# Altium project DClassAmp.PrjPcb (part 2 of 2)

## Sheet ClockGen.SchDoc
size 431 x 279 mm; Organization: ORGANIZATION; Address1: 207; Address2: 13399 104 Ave; Address3: Surrey BC, V3T 0C9; Address4: Canada; Revision: V0.0.0; SheetNumber: 5; SheetTotal: 5; ENG_APP_DATE: --/--/--; DSN_APP_DATE: --/--/--; CHK_APP_DATE: --/--/--
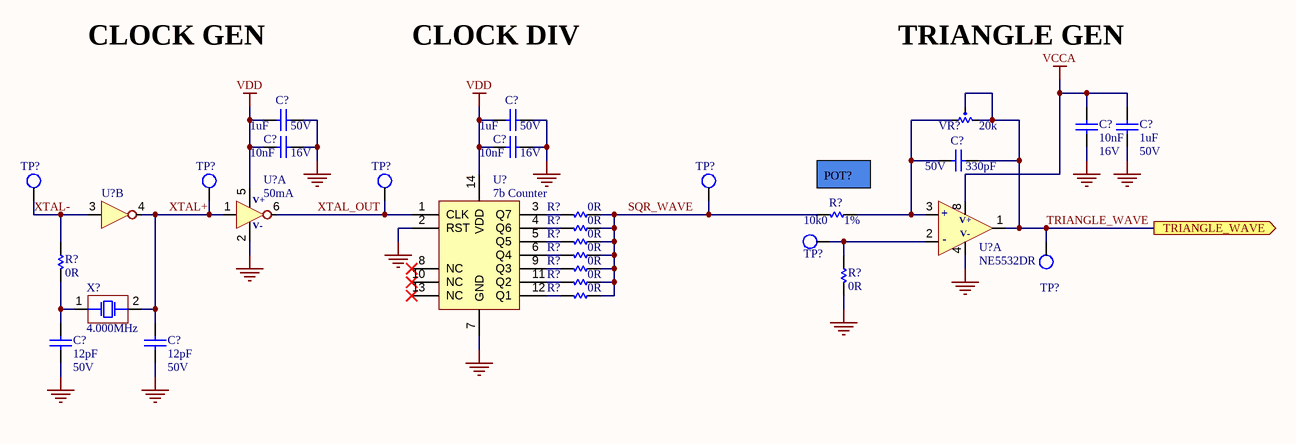
[diagram p2: ClockGen.SchDoc]

### Parts
(Parts that share a designator on the sheet are numbered #1, #2 ... from top to bottom, then left to right.)
C?#11  1uF  Voltage Rating: 50V
C?#12  1uF  Voltage Rating: 50V
C?#13  10nF  Voltage Rating: 16V  [c0402]
C?#14  1uF  Voltage Rating: 50V
C?#15  10nF  Voltage Rating: 16V  [c0402]
C?#16  10nF  Voltage Rating: 16V  [c0402]
C?#17  330pF  Voltage Rating: 50V  [c0402]
C?#18  12pF  Voltage: 50V  [C0402]
C?#19  12pF  Voltage: 50V  [C0402]
R?#19  0R  [R0402]
R?#20  10k0  Tolerance: 1%  [r0402]
R?#21  0R  [R0402]
R?#22  0R  [R0402]
R?#23  0R  [R0402]
R?#24  0R  [R0402]
R?#25  0R  [R0402]
R?#26  0R  [R0402]
R?#27  0R  [R0402]
R?#28  0R  [R0402]
TP?#17  1mm  [TESTPOINT_SMT]  (value not drawn)
TP?#18  1mm  [TESTPOINT_SMT]  (value not drawn)
TP?#19  1mm  [TESTPOINT_SMT]  (value not drawn)
TP?#20  1mm  [TESTPOINT_SMT]  (value not drawn)
TP?#21  1mm  [TESTPOINT_SMT]  (value not drawn)
TP?#22  1mm  [TESTPOINT_SMT]  (value not drawn)
U?#5  50mA  [SOT-23 6 2.9x2.8mm TI DBV0006A]  (value not drawn)  (part B of 2)
U?#6  50mA  [SOT-23 6 2.9x2.8mm TI DBV0006A]  (part A of 2)
U?#7  7b Counter  [SOIC14 8.65x3.9]
U?#8  NE5532DR  [SO8 6.2x5mm TI D0008A]  (part A of 2)
VR?#2  20k  [RV TC33X-2]
X?  4.000MHz  [XTAL 2pin]

### Ports
TRIANGLE_WAVE (out)

### Nets
GND: C?#11.1 C?#12.1 C?#13.1 C?#14.1 C?#15.1 C?#16.1 C?#18.1 C?#19.1 R?#26.2 U?#6.2(GND) U?#7.2(RST) U?#7.7(GND) U?#8.4(V-)
VCCA: C?#13.2 C?#14.2 U?#8.8(V+)
VDD: C?#11.2 C?#12.2 C?#15.2 C?#16.2 U?#6.5(PWR) U?#7.14(VDD)
SQR_WAVE: R?#19.1 R?#20.2 R?#21.1 R?#22.1 R?#24.1 R?#25.1 R?#27.1 R?#28.1 TP?#20.1
TRIANGLE_WAVE: C?#17.1 TP?#22.1 U?#8.1 VR?#2.3 ; port TRIANGLE_WAVE
XTAL+: C?#19.2 TP?#18.1 U?#5.4 U?#6.1 X?.2
XTAL-: R?#23.1 TP?#17.1 U?#5.3
XTAL_OUT: TP?#19.1 U?#6.6 U?#7.1(CLK)
NetC?#17_2: C?#17.2 R?#20.1 U?#8.3(+) VR?#2.1
NetC?#18_2: C?#18.2 R?#23.2 X?.1
NetR?#19_2: R?#19.2 U?#7.3(Q7)
NetR?#21_2: R?#21.2 U?#7.4(Q6)
NetR?#22_2: R?#22.2 U?#7.5(Q5)
NetR?#24_2: R?#24.2 U?#7.6(Q4)
NetR?#25_2: R?#25.2 U?#7.9(Q3)
NetR?#26_1: R?#26.1 TP?#21.1 U?#8.2(-)
NetR?#27_2: R?#27.2 U?#7.11(Q2)
NetR?#28_2: R?#28.2 U?#7.12(Q1)

Not connected (* = marked no-connect by the designer): U?#7 8(NC)* 10(NC)* 13(NC)*

### Notes on the sheet
- CLOCK GEN
- CLOCK DIV
- TRIANGLE GEN
- (near R?#20) POT?
- REV:
- PROJECT:
- DATE:
- TITLE
- SHEET
- OF
- DESIGNED:
- REVIEWED:
- (in symbol IC LOGIC INVERTER 2x 50mA, part A) V+; V-

### Library data of the parts
C?#11 C?#12 C?#14 = CAP CER 1uF 50V X5R 0603: Multilayer Ceramic Capacitors (High dielectric type), 50V, 1 uF, ± 10 %, 0603, X5R, RoHS; Manufacturer: Taiyo Yuden; Manufacturer Part Number: UMK107BJ105KA-T; Tolerance: 10%; Supplier 1: Digi-Key; RoHS: Yes; Category: Ceramic Capacitors; Stock 1: 955108; Pricing 1: 1=0.19000, 10=0.12900, 50=0.07760, 100=0.06560, 500=0.04484, 1000=0.03968 (USD); Mount: Surface Mount; Case/Package: 0603; Number of Pins: 2; Case Code (Metric): 1608; Case Code (Imperial): 0603; Contact Plating: Nickel; Min Operating Temperature: -55°C; Max Operating Temperature: 85°C; Capacitance: 1uF; Packaging: Tape and Reel; Package Quantity: 1; Dielectric: X5R; Voltage Rating (DC): 50V; Termination: SMD/SMT; Series: M; Construction: Flat; Length: 1.6mm; Width: 0.031inch; Height: 0.8mm; Depth: 0.8mm; Thickness: 0.035inch; Radiation Hardening: No; RoHS Compliant: Yes; REACH SVHC: Unknown; Halogen Free: Halogen Free; ComponentLink1URL: https://datasheet.ciiva.com/134/umk107bj105ka-t-ss-134740.pdf?src-supplier=Digi-Key; ComponentLink1Description: https://datasheet.ciiva.com/134/umk107bj105ka-t-ss-134740.pdf?src-supplier=Digi-Key; ComponentLink2URL: https://datasheet.ciiva.com/11601/umk107bj105ka-t-ss-11601811.pdf?src-supplier=Avnet; ComponentLink2Description: https://datasheet.ciiva.com/11601/umk107bj105ka-t-ss-11601811.pdf?src-supplier=Avnet; ComponentLink3URL: https://datasheet.ciiva.com/5744/1697715-5744913.pdf?src-supplier=Farnell; ComponentLink3Description: https://datasheet.ciiva.com/5744/1697715-5744913.pdf?src-supplier=Farnell; ComponentLink4URL: https://datasheet.ciiva.com/30199/43umk107bj105ka-t-30199791.pdf?src-supplier=Onlinecomponents.com; ComponentLink4Description: https://datasheet.ciiva.com/30199/43umk107bj105ka-t-30199791.pdf?src-supplier=Onlinecomponents.com; ComponentLink5URL: https://datasheet.ciiva.com/15922/336umk107bj105ka-t-15922611.pdf?src-supplier=Onlinecomponents.com; ComponentLink5Description: https://datasheet.ciiva.com/15922/336umk107bj105ka-t-15922611.pdf?src-supplier=Onlinecomponents.com; ComponentLink6URL: https://datasheet.ciiva.com/5427/mlcc-all-e-541559-5427036.pdf?src-supplier=Mouser; ComponentLink6Description: https://datasheet.ciiva.com/5427/mlcc-all-e-541559-5427036.pdf?src-supplier=Mouser; ComponentLink7URL: https://datasheet.ciiva.com/7975/mlcc-all-e-7975898.pdf?src-supplier=Element14; ComponentLink7Description: https://datasheet.ciiva.com/7975/mlcc-all-e-7975898.pdf?src-supplier=Element14; ComponentLink8URL: https://datasheet.ciiva.com/7975/1697715-7975608.pdf?src-supplier=Element14; ComponentLink8Description: https://datasheet.ciiva.com/7975/1697715-7975608.pdf?src-supplier=Element14; ComponentLink9URL: https://datasheet.ciiva.com/22694/1697715-22694278.pdf?src-supplier=Element14; ComponentLink9Description: https://datasheet.ciiva.com/22694/1697715-22694278.pdf?src-supplier=Element14; Supplier Part Number 1: 587-2400-1-ND
C?#13 C?#15 C?#16 = CAP CER 10nF 16V Y5V 0402: 0402 10 nF 16 V -20 / +80 % Tolerance Y5V SMT Multilayer Ceramic Capacitor; Manufacturer: Yageo; Manufacturer Part Number: CC0402ZRY5V7BB103; Tolerance: 80%; Insulation Resistance: 100GR; Supplier 1: Future Electronics; RoHS: Yes; Category: Ceramic Capacitors; Stock 1: 10000; Pricing 1: 10000=0.00340, 30000=0.00320, 100000=0.00300, 200000=0.00290, 400000=0.00270 (USD); Mount: Surface Mount; Case/Package: 0402; Number of Pins: 2; Case Code (Imperial): 0402; Case Code (Metric): 1005; Dielectric Material: Ceramic; Min Operating Temperature: -55°C; Max Operating Temperature: 85°C; Capacitance: 10nF; Packaging: Tape and Reel; Voltage Rating (DC): 16V; Dielectric: Y5V; Termination: SMD/SMT; Series: CC; Package Quantity: 10000; Construction: Flat; Length: 1mm; Width: 0.02inch; Height: 0.5mm; Depth: 0.5mm; Thickness: 0.022inch; Terminal Length: 0.225mm; Radiation Hardening: No; RoHS Compliant: Yes; Lead Free: Lead Free; REACH SVHC: No SVHC; Halogen Free: Halogen Free; ComponentLink1URL: https://datasheet.ciiva.com/144/mlccorderingcode-144484.pdf?src-supplier=Digi-Key; ComponentLink1Description: https://datasheet.ciiva.com/144/mlccorderingcode-144484.pdf?src-supplier=Digi-Key; ComponentLink2URL: https://datasheet.ciiva.com/144/mlccorderingcode-144485.pdf?src-supplier=Digi-Key; ComponentLink2Description: https://datasheet.ciiva.com/144/mlccorderingcode-144485.pdf?src-supplier=Digi-Key; ComponentLink3URL: https://datasheet.ciiva.com/144/mlccorderingcode-144486.pdf?src-supplier=Digi-Key; ComponentLink3Description: https://datasheet.ciiva.com/144/mlccorderingcode-144486.pdf?src-supplier=Digi-Key; ComponentLink4URL: https://datasheet.ciiva.com/11586/upy-gphc-y5v-6-3v-to-50v-5-11586517.pdf?src-supplier=Avnet; ComponentLink4Description: https://datasheet.ciiva.com/11586/upy-gphc-y5v-6-3v-to-50v-5-11586517.pdf?src-supplier=Avnet; ComponentLink5URL: https://datasheet.ciiva.com/5789/1132289-5789565.pdf?src-supplier=Farnell; ComponentLink5Description: https://datasheet.ciiva.com/5789/1132289-5789565.pdf?src-supplier=Farnell; ComponentLink6URL: https://datasheet.ciiva.com/5789/1132289-5789566.pdf?src-supplier=Farnell; ComponentLink6Description: https://datasheet.ciiva.com/5789/1132289-5789566.pdf?src-supplier=Farnell; ComponentLink7URL: https://datasheet.ciiva.com/17437/upy-gphc-y5v-6-3v-to-50v-5-17437221.pdf?src-supplier=Avnet+Europe; ComponentLink7Description: https://datasheet.ciiva.com/17437/upy-gphc-y5v-6-3v-to-50v-5-17437221.pdf?src-supplier=Avnet+Europe; ComponentLink8URL: https://datasheet.ciiva.com/8033/1132289-8033641.pdf?src-supplier=Element14; ComponentLink8Description: https://datasheet.ciiva.com/8033/1132289-8033641.pdf?src-supplier=Element14; ComponentLink9URL: https://datasheet.ciiva.com/8033/1132289-8033642.pdf?src-supplier=Element14; ComponentLink9Description: https://datasheet.ciiva.com/8033/1132289-8033642.pdf?src-supplier=Element14; Supplier Part Number 1: 1300987
C?#17 = CAP CER 330pF 50V C0G 0402: Multilayer Ceramic Capacitor, 330 pF, 5%, C0G / NP0, 50 V, 0402 [1005 Metric] RoHS Compliant: Yes; Manufacturer: Walsin Technologies; Manufacturer Part Number: 0402N331J500CT; Supplier 1: Digi-Key; RoHS: Yes; Category: Ceramic Capacitors; Stock 1: 670585; Pricing 1: 1=0.10000, 10=0.02700, 50=0.01460, 100=0.01190, 500=0.00848, 1000=0.00666, 2500=0.00605, 5000=0.00557 (USD); Case/Package: 0402; Case Code (Metric): 1005; Case Code (Imperial): 0402; Min Operating Temperature: -55°C; Max Operating Temperature: 125°C; Tolerance: 5%; Packaging: Tape and Reel; Capacitance: 330pF; Dielectric: C0G; Voltage Rating (DC): 50V; Length: 1mm; Depth: 0.5mm; REACH SVHC: Unknown; RoHS Compliant: Yes; ComponentLink1URL: http://www.farnell.com/datasheets/1958513.pdf?src-supplier=Farnell; ComponentLink1Description: http://www.farnell.com/datasheets/1958513.pdf?src-supplier=Farnell; ComponentLink2URL: http://www.farnell.com/datasheets/2340522.pdf?src-supplier=Farnell; ComponentLink2Description: http://www.farnell.com/datasheets/2340522.pdf?src-supplier=Farnell; ComponentLink3URL: http://components.arrow.com/part/dataview/0323_03460079?src-supplier=Arrow+Europe; ComponentLink3Description: http://components.arrow.com/part/dataview/0323_03460079?src-supplier=Arrow+Europe; ComponentLink4URL: http://www.farnell.com/datasheets/1958513.pdf?src-supplier=Element14; ComponentLink4Description: http://www.farnell.com/datasheets/1958513.pdf?src-supplier=Element14; ComponentLink5URL: http://www.passivecomponent.com/wp-content/uploads/2018/10/MLCC.pdf?src-supplier=Digi-Key; ComponentLink5Description: http://www.passivecomponent.com/wp-content/uploads/2018/10/MLCC.pdf?src-supplier=Digi-Key; Supplier Part Number 1: 1292-1308-1-ND
C?#18 C?#19 = CAP CER 12pF 50V C0G 0402: Ceramic capacitor SMD-0402 12pF /50V C0G# J +-5%, Samsung, RoHS; Manufacturer Part Number: CL05C120JB5NNNC; Tolerance: 5%; Dielectric: C0G; Temperature Coefficient: 300ppm/°C; Supplier 1: Digi-Key; Manufacturer: Samsung; RoHS: Yes; Category: Ceramic Capacitors; Stock 1: 41998; Pricing 1: 10000=0.00386, 20000=0.00367 (USD); Mount: Surface Mount; Case/Package: 0402; Case Code (Metric): 1005; Case Code (Imperial): 0402; Material: Ceramic; Contact Plating: Tin; Min Operating Temperature: -55°C; Max Operating Temperature: 125°C; Capacitance: 12pF; Package Quantity: 1; Packaging: Tape and Reel; Voltage Rating: 50V; Series: CL; Construction: Flat; Voltage Rating (DC): 50V; Length: 1mm; Width: 0.02inch; Height: 0.5mm; Thickness: 0.022inch; Depth: 0.5mm; Radiation Hardening: No; RoHS Compliant: Yes; Lead Free: Lead Free; ComponentLink1URL: https://datasheet.ciiva.com/25806/cl05c120jb5nnnc-25806484.pdf?src-supplier=Digi-Key; ComponentLink1Description: https://datasheet.ciiva.com/25806/cl05c120jb5nnnc-25806484.pdf?src-supplier=Digi-Key; ComponentLink2URL: https://datasheet.ciiva.com/26838/getdatasheetpartid-658047-26838280.pdf?src-supplier=Verical; ComponentLink2Description: https://datasheet.ciiva.com/26838/getdatasheetpartid-658047-26838280.pdf?src-supplier=Verical; ComponentLink3URL: https://datasheet.ciiva.com/29198/458703-da-01-en-vs-kondensator-0402-29198421.pdf?src-supplier=Conrad; ComponentLink3Description: https://datasheet.ciiva.com/29198/458703-da-01-en-vs-kondensator-0402-29198421.pdf?src-supplier=Conrad; ComponentLink4URL: https://datasheet.ciiva.com/16449/cl05b104kq5nnnc-16449055.pdf?src-supplier=Future+Electronics; ComponentLink4Description: https://datasheet.ciiva.com/16449/cl05b104kq5nnnc-16449055.pdf?src-supplier=Future+Electronics; Supplier Part Number 1: 1276-1178-2-ND
R?#19 R?#21-R?#28 = RES 0R 63mW 0402: GLOVE, POLYAMIDE, L/FREE, PU, SIZE 6 - More Details; Manufacturer: Stackpole Electronics; Manufacturer Part Number: RMCF0402ZT0R00; Power Rating: 63mW; Current Rating: 1A; Working Voltage: 50V; Supplier 1: Digi-Key; RoHS: Yes; Category: Chip SMD Resistors; Stock 1: 5203223; Pricing 1: 1=0.10000, 10=0.01000, 25=0.00720, 50=0.00560, 100=0.00410, 250=0.00316, 500=0.00252, 1000=0.00186, 5000=0.00133 (USD); Mount: Surface Mount; Case/Package: 0402; Case Code (Metric): 1005; Case Code (Imperial): 0402; Contact Plating: Tin,Matte; Min Operating Temperature: -55°C; Max Operating Temperature: 155°C; Resistance: 0R; Packaging: Tape and Reel; Resistor Type: Thick Film; Number of Terminations: 2; Max Power Dissipation: 63mW; Features: Automotive AEC-Q200; Series: RMCF; Technology: THICK FILM; Construction: Rectangular; Length: 0.039inch; Width: 0.02inch; Height: 0.016inch; Depth: 0.5mm; Radiation Hardening: No; Military Standard: Not; Lead Free: Lead Free; RoHS Compliant: Yes; ComponentLink1URL: https://datasheet.ciiva.com/26835/getdatasheetpartid-409751-26835612.pdf?src-supplier=Verical; ComponentLink1Description: https://datasheet.ciiva.com/26835/getdatasheetpartid-409751-26835612.pdf?src-supplier=Verical; Supplier Part Number 1: RMCF0402ZT0R00CT-ND
R?#20 = RES 10k0 1% 63mW 0402: Res General Purpose Thick Film 0402 10K Ohm 1% 1/16W ±100ppm/°C Molded SMD Paper T/R; Manufacturer: Yageo; Manufacturer Part Number: RC0402FR-0710KL; Resistance: 10kR; Voltage Rating (DC): 50V; Power Rating: 62.5mW; Max Power Dissipation: 63mW; Supplier 1: RSComponents; RoHS: Yes; Category: Chip SMD Resistors; Stock 1: 29900; Pricing 1: 10000=0.00300 (GBP); Case/Package: 0402; Number of Pins: 2; Case Code (Imperial): 0402; Case Code (Metric): 1005; Min Operating Temperature: -55°C; Max Operating Temperature: 155°C; Resistor Type: Thick Film; Temperature Coefficient: 100ppm/°C; Packaging: Tape and Reel; Voltage Rating: 50V; Termination: SMD/SMT; Working Voltage: 50V; Number of Terminations: 2; Features: Moisture Resistant; Series: RC; Resistance Tolerance: 1%; Construction: Rectangular; Length: 1mm; Width: 0.5mm; Height: 0.32mm; Depth: 0.5mm; Lead Pitch: 0.2mm; REACH SVHC: No SVHC; Lead Free: Lead Free; RoHS Compliant: Yes; Military Standard: Not; ComponentLink1URL: https://datasheet.ciiva.com/7660/38568-7660787.pdf?src-supplier=Element14; ComponentLink1Description: https://datasheet.ciiva.com/7660/38568-7660787.pdf?src-supplier=Element14; ComponentLink2URL: https://datasheet.ciiva.com/12667/pyu-rc0402-51-rohs-l-6-r-12667067.pdf?src-supplier=Mouser; ComponentLink2Description: https://datasheet.ciiva.com/12667/pyu-rc0402-51-rohs-l-6-r-12667067.pdf?src-supplier=Mouser; ComponentLink3URL: https://datasheet.ciiva.com/7849/1784430-7849813.pdf?src-supplier=Element14; ComponentLink3Description: https://datasheet.ciiva.com/7849/1784430-7849813.pdf?src-supplier=Element14; ComponentLink4URL: https://datasheet.ciiva.com/7849/1686128-7849814.pdf?src-supplier=Element14; ComponentLink4Description: https://datasheet.ciiva.com/7849/1686128-7849814.pdf?src-supplier=Element14; ComponentLink5URL: https://datasheet.ciiva.com/7849/1784430-7849815.pdf?src-supplier=Element14; ComponentLink5Description: https://datasheet.ciiva.com/7849/1784430-7849815.pdf?src-supplier=Element14; ComponentLink6URL: https://datasheet.ciiva.com/7983/1018594-7983486.pdf?src-supplier=Element14; ComponentLink6Description: https://datasheet.ciiva.com/7983/1018594-7983486.pdf?src-supplier=Element14; ComponentLink7URL: https://datasheet.ciiva.com/22747/1018594-22747512.pdf?src-supplier=Element14; ComponentLink7Description: https://datasheet.ciiva.com/22747/1018594-22747512.pdf?src-supplier=Element14; Supplier Part Number 1: 1987643
TP?#17-TP?#22 = TP 1mm: SMT testpoint
U?#5 U?#6 = IC LOGIC INVERTER 2x 50mA: Buffer 2-CH Non-Inverting Push-Pull CMOS 6-Pin SOT-23 T/R; Manufacturer: Texas Instruments; Manufacturer Part Number: SN74LVC2G34DBVR; Logic Function: Buffer,Inverting; Min Supply Voltage: 1.65V; Max Supply Voltage: 5.5V; Number of Channels: 2; Propagation Delay: 3.2ns; Number of Bits per Element: 1; High Level Output Current: -32mA; Low Level Output Current: 32mA; Turn-On Delay Time: 8.6ns; Quiescent Current: 10uA; Schmitt Trigger Input: No; Nominal Supply Current: 250mA; Supplier 1: Arrow Electronics; RoHS: Yes; Category: Buffers, Drivers and Transceivers; Stock 1: 261; Pricing 1: 3000=0.09770 (USD); Mount: Surface Mount; Case/Package: SOT-23; Number of Pins: 6; Contact Plating: Tin,Matte; Min Operating Temperature: -40°C; Max Operating Temperature: 125°C; Polarity: Non-Inverting; Packaging: Tape and Reel; Number of Inputs: 2; Number of Outputs: 2; Package Quantity: 3000; Number of Elements: 2; Number of Input Lines: 2; Number of Output Lines: 2; Number of Gates: 2; Number of Bits: 2; Number of Circuits: 2; Output Current: 32mA; Max Output Current: 32mA; Termination: SMD/SMT; Length: 2.9mm; Width: 1.6mm; Height: 1.15mm; Radiation Hardening: No; Lead Free: Lead Free; RoHS Compliant: Yes; REACH SVHC: No SVHC; ComponentLink1URL: https://datasheet.ciiva.com/27051/1046431-27051311.pdf?src-supplier=Jameco; ComponentLink1Description: https://datasheet.ciiva.com/27051/1046431-27051311.pdf?src-supplier=Jameco; ComponentLink2URL: https://datasheet.ciiva.com/7744/1771621-7744033.pdf?src-supplier=Element14; ComponentLink2Description: https://datasheet.ciiva.com/7744/1771621-7744033.pdf?src-supplier=Element14; ComponentLink3URL: https://datasheet.ciiva.com/15094/getdatasheetpartid-133639-15094759.pdf?src-supplier=Verical; ComponentLink3Description: https://datasheet.ciiva.com/15094/getdatasheetpartid-133639-15094759.pdf?src-supplier=Verical; ComponentLink4URL: https://datasheet.ciiva.com/14301/sn74lvc2g34-14301216.pdf?src-supplier=Avnet; ComponentLink4Description: https://datasheet.ciiva.com/14301/sn74lvc2g34-14301216.pdf?src-supplier=Avnet; ComponentLink5URL: https://datasheet.ciiva.com/46439/1785989-46439658.pdf?src-supplier=Element14; ComponentLink5Description: https://datasheet.ciiva.com/46439/1785989-46439658.pdf?src-supplier=Element14; ComponentLink6URL: https://datasheet.ciiva.com/1834/sn74lvc2g34-1834122.pdf?src-supplier=Digi-Key; ComponentLink6Description: https://datasheet.ciiva.com/1834/sn74lvc2g34-1834122.pdf?src-supplier=Digi-Key; ComponentLink7URL: https://datasheet.ciiva.com/1834/sn74lvc2g34-1834121.pdf?src-supplier=Digi-Key; ComponentLink7Description: https://datasheet.ciiva.com/1834/sn74lvc2g34-1834121.pdf?src-supplier=Digi-Key; ComponentLink8URL: https://datasheet.ciiva.com/1834/sn74lvc2g34-1834123.pdf?src-supplier=Digi-Key; ComponentLink8Description: https://datasheet.ciiva.com/1834/sn74lvc2g34-1834123.pdf?src-supplier=Digi-Key; ComponentLink9URL: https://datasheet.ciiva.com/14301/sn74lvc2g34-14301215.pdf?src-supplier=Avnet; ComponentLink9Description: https://datasheet.ciiva.com/14301/sn74lvc2g34-14301215.pdf?src-supplier=Avnet; ComponentLink10URL: https://datasheet.ciiva.com/16532/sn74lvc2g34-16532026.pdf?src-supplier=Avnet+Asia; ComponentLink10Description: https://datasheet.ciiva.com/16532/sn74lvc2g34-16532026.pdf?src-supplier=Avnet+Asia; ComponentLink11URL: https://datasheet.ciiva.com/48703/001074027-da-01-en-ic-buffer-d-sn74lvc2g34dbvr-sot-23-6-tid-48703269.pdf?src-supplier=Conrad; ComponentLink11Description: https://datasheet.ciiva.com/48703/001074027-da-01-en-ic-buffer-d-sn74lvc2g34dbvr-sot-23-6-tid-48703269.pdf?src-supplier=Conrad; Supplier Part Number 1: SN74LVC2G34DBVR
U?#7 = IC LOGIC 7B COUNTER: MC14024BDG 7-stage Binary Counter; Up Counter; 3 - 18 V; 14-Pin SOIC; Manufacturer: ON Semiconductor; Direction: Up,Unidirectional; Max Supply Voltage: 18V; Min Supply Voltage: 3V; Number of Elements: 1; Propagation Delay: 2000ns; Number of Output Lines: 7; Reset: Asynchronous; Frequency: 12MHz; Output Characteristics: DIFFERENTIAL; Supplier 1: Digi-Key; Manufacturer Part Number: MC14024BDG; RoHS: Yes; Category: Counters; Stock 1: 1443; Pricing 1: 1=0.63000, 10=0.55600, 25=0.52240, 100=0.42640, 250=0.39608, 500=0.33708, 1000=0.27825 (USD); Mount: Surface Mount; Case/Package: SOIC; Number of Pins: 14; Min Operating Temperature: -55°C; Max Operating Temperature: 125°C; Packaging: Rail/Tube; Package Quantity: 55; Number of Circuits: 1; Number of Input Lines: 1; Logic Function: Counter; Number of Bits per Element: 7; Number of Bits: 7; Turn-On Delay Time: 2000ns; Series: 4000B; Technology: CMOS; Number of Functions: 1; Supply Voltage-Nom: 18V; Length: 8.75mm; Width: 4mm; Height: 1.5mm; Radiation Hardening: No; REACH SVHC: No SVHC; Lead Free: Lead Free; Halogen Free: Halogen Free; RoHS Compliant: Yes; ComponentLink1URL: https://datasheet.ciiva.com/15093/getdatasheetpartid-147916-15093453.pdf?src-supplier=Verical; ComponentLink1Description: https://datasheet.ciiva.com/15093/getdatasheetpartid-147916-15093453.pdf?src-supplier=Verical; ComponentLink2URL: https://datasheet.ciiva.com/1506/1691447-1506837.pdf?src-supplier=Element14; ComponentLink2Description: https://datasheet.ciiva.com/1506/1691447-1506837.pdf?src-supplier=Element14; ComponentLink3URL: https://datasheet.ciiva.com/1622/76285-1622497.pdf?src-supplier=Newark; ComponentLink3Description: https://datasheet.ciiva.com/1622/76285-1622497.pdf?src-supplier=Newark; ComponentLink4URL: https://datasheet.ciiva.com/16977/0900766b805fa2a2-16977232.pdf?src-supplier=Allied+Electronics; ComponentLink4Description: https://datasheet.ciiva.com/16977/0900766b805fa2a2-16977232.pdf?src-supplier=Allied+Electronics; ComponentLink5URL: https://datasheet.ciiva.com/8252/mc14024b-d-8252619.pdf?src-supplier=Avnet; ComponentLink5Description: https://datasheet.ciiva.com/8252/mc14024b-d-8252619.pdf?src-supplier=Avnet; ComponentLink6URL: https://datasheet.ciiva.com/16392/mc14024b-d-16392830.pdf?src-supplier=Future+Electronics; ComponentLink6Description: https://datasheet.ciiva.com/16392/mc14024b-d-16392830.pdf?src-supplier=Future+Electronics; ComponentLink7URL: https://datasheet.ciiva.com/26221/mc14024b-d-26221639.pdf?src-supplier=Avnet+Europe; ComponentLink7Description: https://datasheet.ciiva.com/26221/mc14024b-d-26221639.pdf?src-supplier=Avnet+Europe; Supplier Part Number 1: MC14024BDGOS-ND
U?#8 = IC OPAMP AUDIO NE5532DR: 2-channel, 10-MHz, 26-V output swing, low-noise audio op amp 8-SOIC 0 to 70; Manufacturer: Texas Instruments; Voltage Gain: 100dB; Min Dual Supply Voltage: 5V; Max Dual Supply Voltage: 15V; Output Current: 38mA; Nominal Supply Current: 16mA; Common Mode Rejection Ratio: 70dB; Number of Channels: 2; Slew Rate: 9V/µs; Gain Bandwidth Product: 10MHz; Input Bias Current: 800nA; Input Offset Voltage (Vos): 4mV; Operating Supply Current: 8mA; Dual Supply Voltage: 9V; Supplier 1: Digi-Key; Manufacturer Part Number: NE5532DR; RoHS: Yes; Category: Amplifiers - Op Amps, Buffer, Instrumentation; Stock 1: 29111; Pricing 1: 1=0.60000, 10=0.51300, 25=0.47840, 100=0.38290, 250=0.35552, 500=0.30082, 1000=0.23246 (USD); Case/Package: D; Number of Pins: 8; Contact Plating: Gold; Min Operating Temperature: 0°C; Max Operating Temperature: 70°C; Packaging: Tape and Reel; Package Quantity: 1; Number of Circuits: 2; Output Current per Channel: 38mA; Nominal Gain Bandwidth Product: 10MHz; Unity Gain Bandwidth Product: 10MHz; Number of Elements: 2; Bandwidth: 10MHz; Max I/O Voltage: 4mV; Max Supply Voltage: 15V; Number of Amplifiers: 2; Length: 4.9mm; Width: 3.91mm; Height: 1.58mm; Radiation Hardening: No; Lead Free: Lead Free; RoHS Compliant: Yes; REACH SVHC: No SVHC; ComponentLink1URL: https://datasheet.ciiva.com/1796/ne5532-1796190.pdf?src-supplier=Digi-Key; ComponentLink1Description: https://datasheet.ciiva.com/1796/ne5532-1796190.pdf?src-supplier=Digi-Key; ComponentLink2URL: https://datasheet.ciiva.com/1796/ne5532-1796189.pdf?src-supplier=Digi-Key; ComponentLink2Description: https://datasheet.ciiva.com/1796/ne5532-1796189.pdf?src-supplier=Digi-Key; ComponentLink3URL: https://datasheet.ciiva.com/1796/ne5532-1796191.pdf?src-supplier=Digi-Key; ComponentLink3Description: https://datasheet.ciiva.com/1796/ne5532-1796191.pdf?src-supplier=Digi-Key; Supplier Part Number 1: 296-13622-1-ND
VR?#2 = TC33X-2-203E: Res Trimmer 20K Ohm 25% 1/10W 1(Elec)/1(Mech)Turn (3 X 3.8mm) Foot Print SMD Embossed T/R; Manufacturer: Bourns; Resistance: 20kR; Power Rating: 100mW; Number of Turns: 1; Temperature Coefficient: 250ppm/°C; Supplier 1: Digi-Key; Manufacturer Part Number: TC33X-2-203E; RoHS: Yes; Category: Variable Resistors and Potentiometers; Stock 1: 95244; Pricing 1: 1=0.26000, 10=0.25200, 25=0.22760, 50=0.21700, 100=0.21000, 250=0.19600, 500=0.17850, 1000=0.16100 (USD); Mount: Surface Mount; Min Operating Temperature: -40°C; Max Operating Temperature: 100°C; Tolerance: 25%; Packaging: Tape and Reel; Package Quantity: 2500; Resistor Type: Cermet; Termination: Foot Print; Max Power Dissipation: 100mW; Series: TC33; Resistance Tolerance: 25%; Length: 3mm; Width: 0.118inch; Height: 0.047inch; Depth: 3.8mm; Radiation Hardening: No; REACH SVHC: No SVHC; Military Standard: Not; RoHS Compliant: Yes; ComponentLink1URL: https://datasheet.ciiva.com/22671/1537288-22671216.pdf?src-supplier=Element14; ComponentLink1Description: https://datasheet.ciiva.com/22671/1537288-22671216.pdf?src-supplier=Element14; ComponentLink2URL: https://datasheet.ciiva.com/11833/0900766b802749b3-11833400.pdf?src-supplier=RSComponents; ComponentLink2Description: https://datasheet.ciiva.com/11833/0900766b802749b3-11833400.pdf?src-supplier=RSComponents; ComponentLink3URL: https://datasheet.ciiva.com/6227/tc33-6227117.pdf?src-supplier=Digi-Key; ComponentLink3Description: https://datasheet.ciiva.com/6227/tc33-6227117.pdf?src-supplier=Digi-Key; ComponentLink4URL: https://datasheet.ciiva.com/6227/tc33-6227118.pdf?src-supplier=Digi-Key; ComponentLink4Description: https://datasheet.ciiva.com/6227/tc33-6227118.pdf?src-supplier=Digi-Key; ComponentLink5URL: https://datasheet.ciiva.com/6227/tc33-6227119.pdf?src-supplier=Digi-Key; ComponentLink5Description: https://datasheet.ciiva.com/6227/tc33-6227119.pdf?src-supplier=Digi-Key; ComponentLink6URL: https://datasheet.ciiva.com/30078/tc33-30078556.pdf?src-supplier=Onlinecomponents.com; ComponentLink6Description: https://datasheet.ciiva.com/30078/tc33-30078556.pdf?src-supplier=Onlinecomponents.com; ComponentLink7URL: https://datasheet.ciiva.com/15156/getdatasheetpartid-128027-15156621.pdf?src-supplier=Verical; ComponentLink7Description: https://datasheet.ciiva.com/15156/getdatasheetpartid-128027-15156621.pdf?src-supplier=Verical; ComponentLink8URL: https://datasheet.ciiva.com/7953/1818686-7953350.pdf?src-supplier=Element14; ComponentLink8Description: https://datasheet.ciiva.com/7953/1818686-7953350.pdf?src-supplier=Element14; ComponentLink9URL: https://datasheet.ciiva.com/22718/1520225-22718588.pdf?src-supplier=Element14; ComponentLink9Description: https://datasheet.ciiva.com/22718/1520225-22718588.pdf?src-supplier=Element14; Supplier Part Number 1: TC33X-2-203ECT-ND
X? = XTAL 4.000MHz 18pF HC-49: Crystal 4MHz ±30ppm (Tol) ±50ppm (Stability) 18pF FUND 180Ohm 2-Pin HC-49/US SMD T/R; Manufacturer: Abracon; Manufacturer Part Number: ABLS-4.000MHZ-B4-T; ESR (Equivalent Series Resistance): 180R; Supplier 1: Digi-Key; RoHS: Yes; Category: Crystals; Stock 1: 302; Pricing 1: 1=0.32000, 10=0.26400, 50=0.23760, 100=0.21120, 500=0.20064 (USD); Mount: Surface Mount; Case/Package: SMD/SMT; Min Operating Temperature: -20°C; Max Operating Temperature: 70°C; Package Quantity: 1000; Frequency: 4MHz; Frequency Tolerance: 30ppm; Load Capacitance: 18pF; Packaging: Tape and Reel; Tolerance: 30ppm; Frequency Stability: 50ppm; Termination: SMD/SMT; Series: ABLS; Series Resistance: 180R; Operating Frequency: 4 MHz; Length: 11.4mm; Width: 0.185inch; Height: 0.165inch; Depth: 4.7mm; Radiation Hardening: No; REACH SVHC: Yes; Lead Free: Lead Free; ComponentLink1URL: https://datasheet.ciiva.com/15116/getdatasheetpartid-723826-15116860.pdf?src-supplier=Verical; ComponentLink1Description: https://datasheet.ciiva.com/15116/getdatasheetpartid-723826-15116860.pdf?src-supplier=Verical; ComponentLink2URL: https://datasheet.ciiva.com/860/abls-860304.pdf?src-supplier=Digi-Key; ComponentLink2Description: https://datasheet.ciiva.com/860/abls-860304.pdf?src-supplier=Digi-Key; ComponentLink3URL: https://datasheet.ciiva.com/860/abls-860305.pdf?src-supplier=Digi-Key; ComponentLink3Description: https://datasheet.ciiva.com/860/abls-860305.pdf?src-supplier=Digi-Key; ComponentLink4URL: https://datasheet.ciiva.com/860/abls-860306.pdf?src-supplier=Digi-Key; ComponentLink4Description: https://datasheet.ciiva.com/860/abls-860306.pdf?src-supplier=Digi-Key; ComponentLink5URL: https://datasheet.ciiva.com/3175/abls-3175417.pdf?src-supplier=Avnet; ComponentLink5Description: https://datasheet.ciiva.com/3175/abls-3175417.pdf?src-supplier=Avnet; Supplier Part Number 1: 535-10202-1-ND

## Sheet AudioOutput.SchDoc
size 431 x 279 mm; Organization: ORGANIZATION; Address1: 207; Address2: 13399 104 Ave; Address3: Surrey BC, V3T 0C9; Address4: Canada; Revision: V0.0.0; SheetNumber: 4; SheetTotal: 5; ENG_APP_DATE: --/--/--; DSN_APP_DATE: --/--/--; CHK_APP_DATE: --/--/--
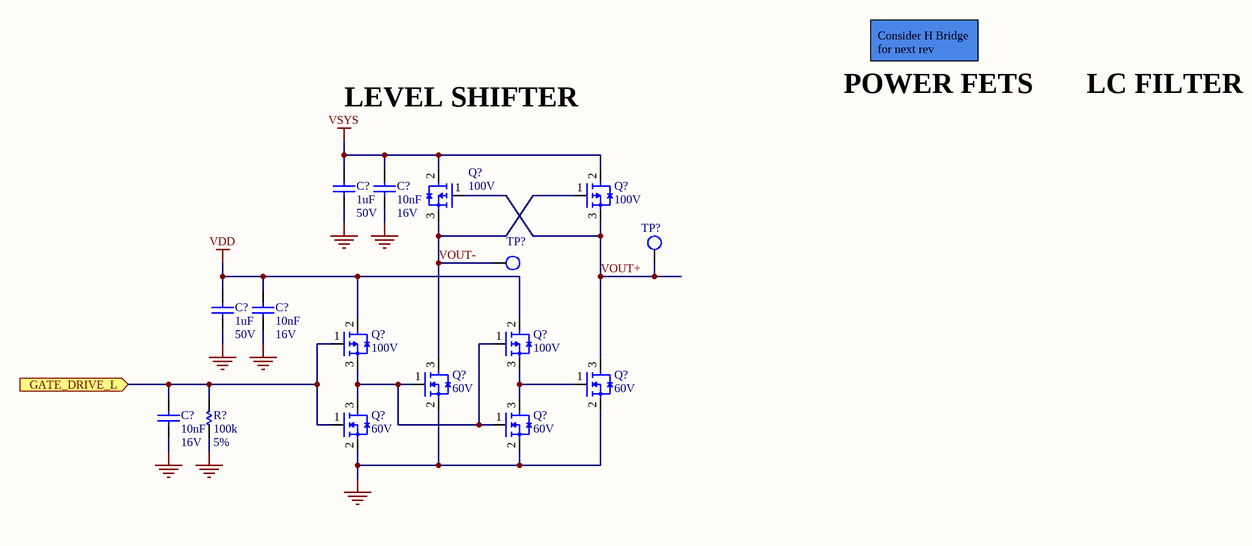
[diagram p3: AudioOutput.SchDoc]

### Parts
(Parts that share a designator on the sheet are numbered #1, #2 ... from top to bottom, then left to right.)
C?#20  1uF  Voltage Rating: 50V
C?#21  10nF  Voltage Rating: 16V  [c0402]
C?#22  1uF  Voltage Rating: 50V
C?#23  10nF  Voltage Rating: 16V  [c0402]
C?#24  10nF  Voltage Rating: 16V  [c0402]
Q?#1  100V  [SOT 23-3]
Q?#2  100V  [SOT 23-3]
Q?#3  100V  [SOT 23-3]
Q?#4  100V  [SOT 23-3]
Q?#5  60V  [SOT 23-3]
Q?#6  60V  [SOT 23-3]
Q?#7  60V  [SOT 23-3]
Q?#8  60V  [SOT 23-3]
R?#29  100k  Tolerance: 5%  [R0402]
TP?#23  1mm  [TESTPOINT_SMT]  (value not drawn)
TP?#24  1mm  [TESTPOINT_SMT]  (value not drawn)

### Ports
GATE_DRIVE_L (in)

### Nets
GND: C?#20.1 C?#21.1 C?#22.1 C?#23.1 C?#24.1 Q?#5.2(S) Q?#6.2(S) Q?#7.2(S) Q?#8.2(S) R?#29.1
VDD: C?#22.2 C?#23.2 Q?#3.2(S) Q?#4.2(S)
VSYS: C?#20.2 C?#21.2 Q?#1.2(S) Q?#2.2(S)
VOUT+: Q?#1.1(G) Q?#2.3(S) Q?#6.3(D) TP?#24.1
VOUT-: Q?#1.3(S) Q?#2.1(G) Q?#5.3(D) TP?#23.1
NetC?#24_2: C?#24.2 Q?#3.1(G) Q?#7.1(G) R?#29.2 ; port GATE_DRIVE_L
NetQ?#3_3: Q?#3.3(S) Q?#4.1(G) Q?#5.1(G) Q?#7.3(D) Q?#8.1(G)
NetQ?#4_3: Q?#4.3(S) Q?#6.1(G) Q?#8.3(D)

### Notes on the sheet
- LEVEL SHIFTER
- POWER FETS
- Consider H Bridge for next rev
- LC FILTER
- REV:
- PROJECT:
- DATE:
- TITLE
- SHEET
- OF
- DESIGNED:
- REVIEWED:

### Library data of the parts
C?#20 C?#22 = CAP CER 1uF 50V X5R 0603: as C?#11 on sheet ClockGen; Supplier 1: Digi-Key; RoHS: Yes; Category: Ceramic Capacitors; Stock 1: 955108; Pricing 1: 1=0.19000, 10=0.12900, 50=0.07760, 100=0.06560, 500=0.04484, 1000=0.03968 (USD); Mount: Surface Mount; Case/Package: 0603; Number of Pins: 2; Case Code (Metric): 1608; Case Code (Imperial): 0603; Contact Plating: Nickel; Min Operating Temperature: -55°C; Max Operating Temperature: 85°C; Capacitance: 1uF; Packaging: Tape and Reel; Package Quantity: 1; Dielectric: X5R; Voltage Rating (DC): 50V; Termination: SMD/SMT; Series: M; Construction: Flat; Length: 1.6mm; Width: 0.031inch; Height: 0.8mm; Depth: 0.8mm; Thickness: 0.035inch; Radiation Hardening: No; RoHS Compliant: Yes; REACH SVHC: Unknown; Halogen Free: Halogen Free; ComponentLink1URL: https://datasheet.ciiva.com/134/umk107bj105ka-t-ss-134740.pdf?src-supplier=Digi-Key; ComponentLink1Description: https://datasheet.ciiva.com/134/umk107bj105ka-t-ss-134740.pdf?src-supplier=Digi-Key; ComponentLink2URL: https://datasheet.ciiva.com/11601/umk107bj105ka-t-ss-11601811.pdf?src-supplier=Avnet; ComponentLink2Description: https://datasheet.ciiva.com/11601/umk107bj105ka-t-ss-11601811.pdf?src-supplier=Avnet; ComponentLink3URL: https://datasheet.ciiva.com/5744/1697715-5744913.pdf?src-supplier=Farnell; ComponentLink3Description: https://datasheet.ciiva.com/5744/1697715-5744913.pdf?src-supplier=Farnell; ComponentLink4URL: https://datasheet.ciiva.com/30199/43umk107bj105ka-t-30199791.pdf?src-supplier=Onlinecomponents.com; ComponentLink4Description: https://datasheet.ciiva.com/30199/43umk107bj105ka-t-30199791.pdf?src-supplier=Onlinecomponents.com; ComponentLink5URL: https://datasheet.ciiva.com/15922/336umk107bj105ka-t-15922611.pdf?src-supplier=Onlinecomponents.com; ComponentLink5Description: https://datasheet.ciiva.com/15922/336umk107bj105ka-t-15922611.pdf?src-supplier=Onlinecomponents.com; ComponentLink6URL: https://datasheet.ciiva.com/5427/mlcc-all-e-541559-5427036.pdf?src-supplier=Mouser; ComponentLink6Description: https://datasheet.ciiva.com/5427/mlcc-all-e-541559-5427036.pdf?src-supplier=Mouser; ComponentLink7URL: https://datasheet.ciiva.com/7975/mlcc-all-e-7975898.pdf?src-supplier=Element14; ComponentLink7Description: https://datasheet.ciiva.com/7975/mlcc-all-e-7975898.pdf?src-supplier=Element14; ComponentLink8URL: https://datasheet.ciiva.com/7975/1697715-7975608.pdf?src-supplier=Element14; ComponentLink8Description: https://datasheet.ciiva.com/7975/1697715-7975608.pdf?src-supplier=Element14; ComponentLink9URL: https://datasheet.ciiva.com/22694/1697715-22694278.pdf?src-supplier=Element14; ComponentLink9Description: https://datasheet.ciiva.com/22694/1697715-22694278.pdf?src-supplier=Element14; Supplier Part Number 1: 587-2400-1-ND
C?#21 C?#23 C?#24 = CAP CER 10nF 16V Y5V 0402: as C?#13 on sheet ClockGen; Supplier 1: Future Electronics; RoHS: Yes; Category: Ceramic Capacitors; Stock 1: 10000; Pricing 1: 10000=0.00340, 30000=0.00320, 100000=0.00300, 200000=0.00290, 400000=0.00270 (USD); Mount: Surface Mount; Case/Package: 0402; Number of Pins: 2; Case Code (Imperial): 0402; Case Code (Metric): 1005; Dielectric Material: Ceramic; Min Operating Temperature: -55°C; Max Operating Temperature: 85°C; Capacitance: 10nF; Packaging: Tape and Reel; Voltage Rating (DC): 16V; Dielectric: Y5V; Termination: SMD/SMT; Series: CC; Package Quantity: 10000; Construction: Flat; Length: 1mm; Width: 0.02inch; Height: 0.5mm; Depth: 0.5mm; Thickness: 0.022inch; Terminal Length: 0.225mm; Radiation Hardening: No; RoHS Compliant: Yes; Lead Free: Lead Free; REACH SVHC: No SVHC; Halogen Free: Halogen Free; ComponentLink1URL: https://datasheet.ciiva.com/144/mlccorderingcode-144484.pdf?src-supplier=Digi-Key; ComponentLink1Description: https://datasheet.ciiva.com/144/mlccorderingcode-144484.pdf?src-supplier=Digi-Key; ComponentLink2URL: https://datasheet.ciiva.com/144/mlccorderingcode-144485.pdf?src-supplier=Digi-Key; ComponentLink2Description: https://datasheet.ciiva.com/144/mlccorderingcode-144485.pdf?src-supplier=Digi-Key; ComponentLink3URL: https://datasheet.ciiva.com/144/mlccorderingcode-144486.pdf?src-supplier=Digi-Key; ComponentLink3Description: https://datasheet.ciiva.com/144/mlccorderingcode-144486.pdf?src-supplier=Digi-Key; ComponentLink4URL: https://datasheet.ciiva.com/11586/upy-gphc-y5v-6-3v-to-50v-5-11586517.pdf?src-supplier=Avnet; ComponentLink4Description: https://datasheet.ciiva.com/11586/upy-gphc-y5v-6-3v-to-50v-5-11586517.pdf?src-supplier=Avnet; ComponentLink5URL: https://datasheet.ciiva.com/5789/1132289-5789565.pdf?src-supplier=Farnell; ComponentLink5Description: https://datasheet.ciiva.com/5789/1132289-5789565.pdf?src-supplier=Farnell; ComponentLink6URL: https://datasheet.ciiva.com/5789/1132289-5789566.pdf?src-supplier=Farnell; ComponentLink6Description: https://datasheet.ciiva.com/5789/1132289-5789566.pdf?src-supplier=Farnell; ComponentLink7URL: https://datasheet.ciiva.com/17437/upy-gphc-y5v-6-3v-to-50v-5-17437221.pdf?src-supplier=Avnet+Europe; ComponentLink7Description: https://datasheet.ciiva.com/17437/upy-gphc-y5v-6-3v-to-50v-5-17437221.pdf?src-supplier=Avnet+Europe; ComponentLink8URL: https://datasheet.ciiva.com/8033/1132289-8033641.pdf?src-supplier=Element14; ComponentLink8Description: https://datasheet.ciiva.com/8033/1132289-8033641.pdf?src-supplier=Element14; ComponentLink9URL: https://datasheet.ciiva.com/8033/1132289-8033642.pdf?src-supplier=Element14; ComponentLink9Description: https://datasheet.ciiva.com/8033/1132289-8033642.pdf?src-supplier=Element14; Supplier Part Number 1: 1300987
Q?#1-Q?#4 = TRANS PMOS 100V SOT-23-3: DMP10H4D2S Series 100V 270 mA P-Channel Enhancement Mode Mosfet - SOT-23-3; Manufacturer: Diodes; Manufacturer Part Number: DMP10H4D2S-7; Continuous Drain Current (ID): 270mA; Rds On Max: 4.2R; Input Capacitance: 87pF; Max Power Dissipation: 380mW; Supplier 1: Digi-Key; RoHS: Yes; Category: MOSFETs; Stock 1: 1201; Pricing 1: 1=0.44000, 10=0.33100, 100=0.20650, 500=0.14128, 1000=0.10868 (USD); Mount: Surface Mount; Case/Package: TO-236-3; Min Operating Temperature: -55°C; Max Operating Temperature: 150°C; Packaging: Tape and Reel; Drain to Source Voltage (Vdss): 100V; ComponentLink1URL: http://www.farnell.com/datasheets/2814419.pdf?src-supplier=Farnell; ComponentLink1Description: http://www.farnell.com/datasheets/2814419.pdf?src-supplier=Farnell; ComponentLink2URL: http://www.mouser.com/ds/2/115/DMP10H4D2S-773915.pdf?src-supplier=Mouser; ComponentLink2Description: http://www.mouser.com/ds/2/115/DMP10H4D2S-773915.pdf?src-supplier=Mouser; ComponentLink3URL: https://www.diodes.com/assets/Datasheets/DMP10H4D2S.pdf?src-supplier=Digi-Key; ComponentLink3Description: https://www.diodes.com/assets/Datasheets/DMP10H4D2S.pdf?src-supplier=Digi-Key; ComponentLink4URL: http://www.farnell.com/datasheets/2814419.pdf?src-supplier=Element14; ComponentLink4Description: http://www.farnell.com/datasheets/2814419.pdf?src-supplier=Element14; ComponentLink5URL: http://www.farnell.com/datasheets/2814419.pdf?src-supplier=Newark; ComponentLink5Description: http://www.farnell.com/datasheets/2814419.pdf?src-supplier=Newark; Supplier Part Number 1: DMP10H4D2S-7DICT-ND
Q?#5-Q?#8 = TRANS NMOS 60V SOT-23-3: N-Channel 60 V 0.2 W Surface Mount 2.5 V Drive Silicon Power Mosfet - SOT-23; Manufacturer: Rohm; Manufacturer Part Number: RK7002BMT116; Rds On Max: 2.4R; Input Capacitance: 15pF; Continuous Drain Current (ID): 250mA; Max Power Dissipation: 200mW; Number of Channels: 1; Drain to Source Resistance: 1.7R; Gate to Source Voltage (Vgs): 20V; Fall Time: 28ns; Rise Time: 5ns; Turn-Off Delay Time: 18ns; Turn-On Delay Time: 3.5ns; FET Type: 1 N-Channel; Supplier 1: Digi-Key; RoHS: Yes; Category: MOSFETs; Stock 1: 68809; Pricing 1: 1=0.16000, 10=0.14900, 100=0.08100, 500=0.04986, 1000=0.03399 (USD); Mount: Surface Mount; Case/Package: TO-236-3; Max Operating Temperature: 150°C; Package Quantity: 3000; Packaging: Tape and Reel; Drain to Source Voltage (Vdss): 60V; Drain to Source Breakdown Voltage: 60V; Lead Free: Lead Free; RoHS Compliant: Yes; ComponentLink1URL: http://www.farnell.com/datasheets/2197948.pdf?src-supplier=Farnell; ComponentLink1Description: http://www.farnell.com/datasheets/2197948.pdf?src-supplier=Farnell; ComponentLink2URL: http://www.mouser.com/ds/2/348/rk7002bmt116-e-1018209.pdf?src-supplier=Mouser; ComponentLink2Description: http://www.mouser.com/ds/2/348/rk7002bmt116-e-1018209.pdf?src-supplier=Mouser; ComponentLink3URL: http://rohmfs.rohm.com/en/techdata_basic/transistor/taping/SST3_T116_taping.pdf?src-supplier=Digi-Key; ComponentLink3Description: http://rohmfs.rohm.com/en/techdata_basic/transistor/taping/SST3_T116_taping.pdf?src-supplier=Digi-Key; ComponentLink4URL: http://rohmfs.rohm.com/en/products/databook/datasheet/discrete/transistor/mosfet/rk7002bm.pdf?src-supplier=Avnet; ComponentLink4Description: http://rohmfs.rohm.com/en/products/databook/datasheet/discrete/transistor/mosfet/rk7002bm.pdf?src-supplier=Avnet; ComponentLink5URL: http://www.farnell.com/datasheets/2197948.pdf?src-supplier=Newark; ComponentLink5Description: http://www.farnell.com/datasheets/2197948.pdf?src-supplier=Newark; ComponentLink6URL: http://www.farnell.com/datasheets/2197948.pdf?src-supplier=Element14; ComponentLink6Description: http://www.farnell.com/datasheets/2197948.pdf?src-supplier=Element14; Supplier Part Number 1: RK7002BMT116CT-ND
R?#29 = RES 100k 5% 63mW 0402: Res Thick Film 0402 100K Ohm 5% 1/16W ±200ppm/°C Molded SMD SMD; Manufacturer: TE Connectivity; Manufacturer Part Number: CRG0402J100K/10; Resistance: 100kR; Power Rating: 63mW; Voltage Rating (DC): 50V; Supplier 1: Digi-Key; RoHS: Yes; Category: Chip SMD Resistors; Stock 1: 463648; Pricing 1: 1=0.10000, 10=0.02000, 100=0.00820, 1000=0.00369, 2500=0.00320, 5000=0.00264 (USD); Mount: Surface Mount; Case/Package: 0402; Case Code (Imperial): 0402; Weight: 2.3E-05oz; Min Operating Temperature: -55°C; Max Operating Temperature: 125°C; Package Quantity: 10000; Packaging: Tape and Reel; Resistor Type: Thick Film; Number of Terminations: 2; Temperature Coefficient: 200ppm/°C; Max Power Dissipation: 63mW; Voltage Rating: 50V; Series: CRG, Neohm; Termination: SMD/SMT; Technology: THICK FILM; Construction: Rectangular; Resistance Tolerance: 5%; Length: 1mm; Width: 0.5mm; Height: 0.35mm; Depth: 0.5mm; Radiation Hardening: No; Military Standard: Not; ELV: Compliant; REACH SVHC: Unknown; RoHS Compliant: Yes; ComponentLink1URL: https://datasheet.ciiva.com/11810/0900766b800a696e-11810123.pdf?src-supplier=RSComponents; ComponentLink1Description: https://datasheet.ciiva.com/11810/0900766b800a696e-11810123.pdf?src-supplier=RSComponents; ComponentLink2URL: https://datasheet.ciiva.com/30197/eng-ds-1773204-e-30197534.pdf?src-supplier=Onlinecomponents.com; ComponentLink2Description: https://datasheet.ciiva.com/30197/eng-ds-1773204-e-30197534.pdf?src-supplier=Onlinecomponents.com; ComponentLink3URL: https://datasheet.ciiva.com/2529/eng-ds-1773204-i-2529694.pdf?src-supplier=Digi-Key; ComponentLink3Description: https://datasheet.ciiva.com/2529/eng-ds-1773204-i-2529694.pdf?src-supplier=Digi-Key; Supplier Part Number 1: A121521CT-ND
TP?#23 TP?#24 = TP 1mm: SMT testpoint

## Sheet Power.SchDoc
size 431 x 279 mm; Organization: ORGANIZATION; Address1: 207; Address2: 13399 104 Ave; Address3: Surrey BC, V3T 0C9; Address4: Canada; Revision: V0.0.0; SheetNumber: 2; SheetTotal: 5; ENG_APP_DATE: --/--/--; DSN_APP_DATE: --/--/--; CHK_APP_DATE: --/--/--
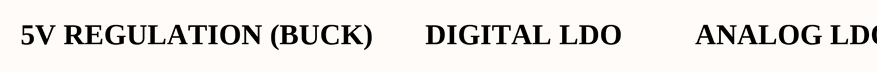
[diagram p4: Power.SchDoc]

### Notes on the sheet
- 5V REGULATION (BUCK)
- DIGITAL LDO
- ANALOG LDO
- REV:
- PROJECT:
- DATE:
- TITLE
- SHEET
- OF
- DESIGNED:
- REVIEWED:

## Nets that join several sheets
GND: AudioInput (15 pins), ClockGen (13 pins), AudioOutput (10 pins)
VCCA: AudioInput (9 pins), ClockGen (C?#13.2 C?#14.2 U?#8.8)
VDD: ClockGen (6 pins), AudioOutput (C?#22.2 C?#23.2 Q?#3.2 Q?#4.2)
INPUT_FILT_OUT: DClassAmp (R?#3.2), AudioInput (C?#8.2 FB?.2 TP?#12.1)
NetC?#24_2: DClassAmp (R?#2.1), AudioOutput (C?#24.2 Q?#3.1 Q?#7.1 R?#29.2)
TRIANGLE_WAVE: DClassAmp (R?#1.2), ClockGen (C?#17.1 TP?#22.1 U?#8.1 VR?#2.3)